# EAGLE design MAINBOARD (EAGLE 7.6.0)
AUTHOR: F. Burian / T. Divacky; PROJECT_DESC: Main driver board; PROJECT_NAME: KAMbot; REVISION: A
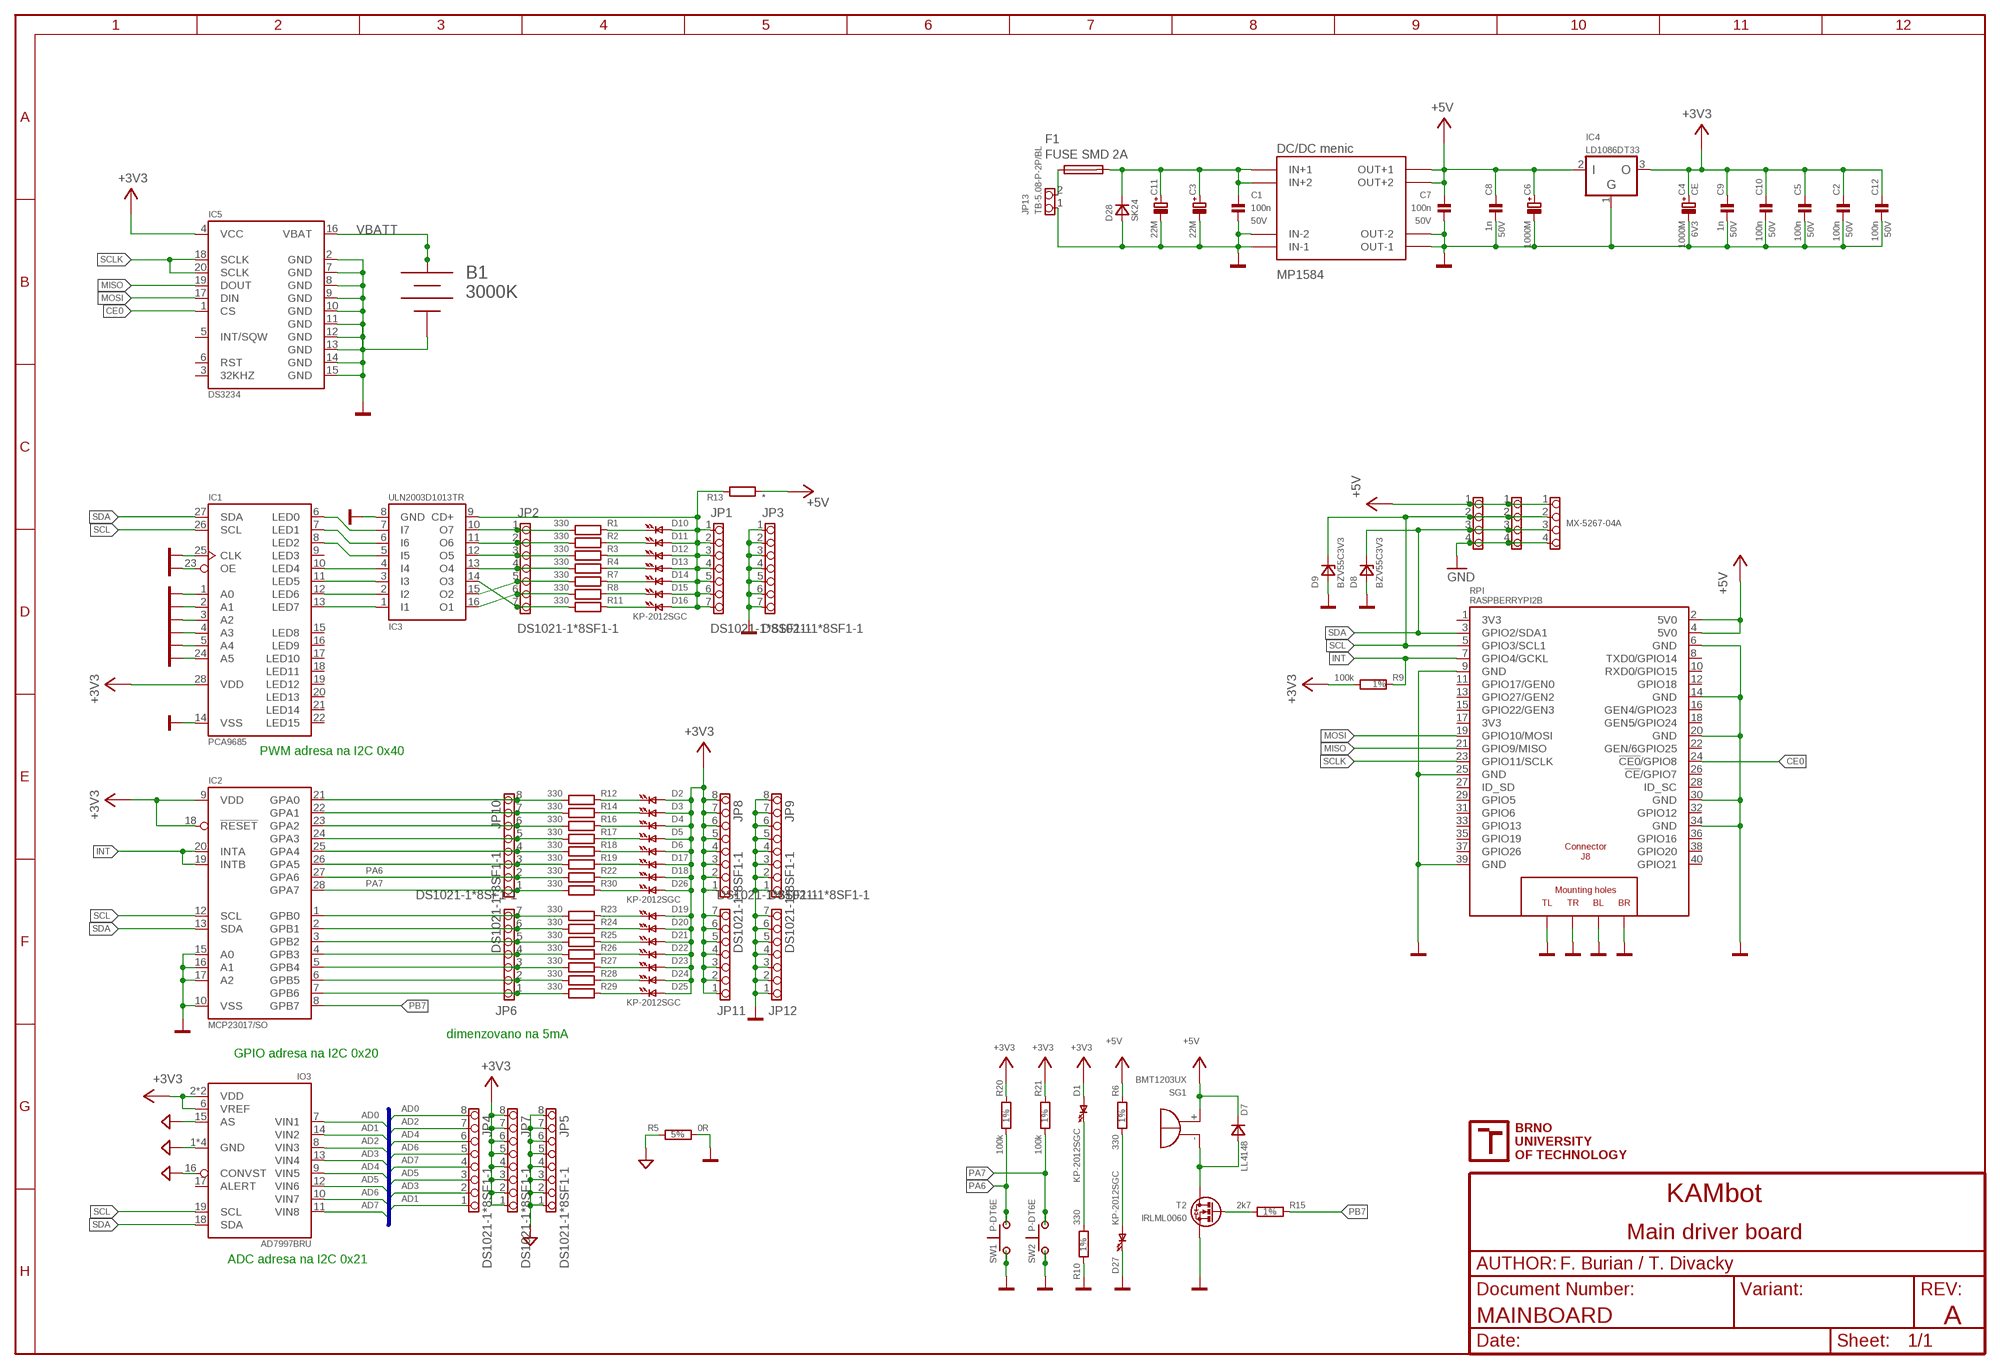
[diagram p0: schematic, sheet 1]

## Parts
B1  3000K  [3000K]
C1  100n  C0805  [0805]
C2  100n  C0805  [0805]
C3  22M  CECT7343  [CT7343D]
C4  1000M  CE_D10L13_L  [CE_D10L13_L]
C5  100n  C0805  [0805]
C6  1000M  CE_D10L13_R  [CE_D10L13_R]
C7  100n  C0805  [0805]
C8  1n  C0805  [0805]
C9  1n  C0805  [0805]
C10  100n  C0805  [0805]
C11  22M  CECT7343  [CT7343D]
C12  100n  C0805  [0805]
D1  KP-2012SGC  LED0805  [LED_0805]
D2  KP-2012SGC  LED0805  [LED_0805]
D3  KP-2012SGC  LED0805  [LED_0805]
D4  KP-2012SGC  LED0805  [LED_0805]
D5  KP-2012SGC  LED0805  [LED_0805]
D6  KP-2012SGC  LED0805  [LED_0805]
D7  LL4148  D_SOD80  [D_SOD80]
D8  BZV55C3V3  D_ZENER_SOD80  [D_SOD80]
D9  BZV55C3V3  D_ZENER_SOD80  [D_SOD80]
D10  KP-2012SGC  LED0805  [LED_0805]
D11  KP-2012SGC  LED0805  [LED_0805]
D12  KP-2012SGC  LED0805  [LED_0805]
D13  KP-2012SGC  LED0805  [LED_0805]
D14  KP-2012SGC  LED0805  [LED_0805]
D15  KP-2012SGC  LED0805  [LED_0805]
D16  KP-2012SGC  LED0805  [LED_0805]
D17  KP-2012SGC  LED0805  [LED_0805]
D18  KP-2012SGC  LED0805  [LED_0805]
D19  KP-2012SGC  LED0805  [LED_0805]
D20  KP-2012SGC  LED0805  [LED_0805]
D21  KP-2012SGC  LED0805  [LED_0805]
D22  KP-2012SGC  LED0805  [LED_0805]
D23  KP-2012SGC  LED0805  [LED_0805]
D24  KP-2012SGC  LED0805  [LED_0805]
D25  KP-2012SGC  LED0805  [LED_0805]
D26  KP-2012SGC  LED0805  [LED_0805]
D27  KP-2012SGC  LED0805  [LED_0805]
D28  SK24  D_SMB  [D_SMB]
DC1  MP1584  DC-DC-STEPDOWN-MALEJ  [DC-DC-STEP-DOWN-MALEJ]
F1  FUSE SMD 2A  FUSE_SMD_OMNI-BLOK  [FUSE_SMD]
IC1  PCA9685  [TSSOP28]
IC2  MCP23017/SO  [SO28W]
IC3  ULN2003D1013TR  ULN200X_SO  [SO16]
IC4  LD1086DT33  LD1086  [TO252]
IC5  DS3234  [SO20W]
IO3  AD7997BRU  [TSSOP20]
JP1  DS1021-1*8SF1-1  PINHD-1X7  [1X07_254_M]
JP2  DS1021-1*8SF1-1  PINHD-1X7  [1X07_254_M]
JP3  DS1021-1*8SF1-1  PINHD-1X7  [1X07_254_M]
JP4  DS1021-1*8SF1-1  PINHD-1X8  [1X08_254_M]
JP5  DS1021-1*8SF1-1  PINHD-1X8  [1X08_254_M]
JP6  DS1021-1*8SF1-1  PINHD-1X7  [1X07_254_M]
JP7  DS1021-1*8SF1-1  PINHD-1X8  [1X08_254_M]
JP8  DS1021-1*8SF1-1  PINHD-1X8  [1X08_254_M]
JP9  DS1021-1*8SF1-1  PINHD-1X8  [1X08_254_M]
JP10  DS1021-1*8SF1-1  PINHD-1X8  [1X08_254_M]
JP11  DS1021-1*8SF1-1  PINHD-1X7  [1X07_254_M]
JP12  DS1021-1*8SF1-1  PINHD-1X7  [1X07_254_M]
JP13  TB-5.08-P-2P/BL  PINHD-1X2_508_SROUB  [1X02_508_SROUB]
JP19  MX-5267-04A  PINHD-1X4_250_MX5267  [1X04_250_MX5267]
JP25  MX-5267-04A  PINHD-1X4_250_MX5267  [1X04_250_MX5267]
JP26  MX-5267-04A  PINHD-1X4_250_MX5267  [1X04_250_MX5267]
R1  330  R_R0805  [0805]
R2  330  R_R0805  [0805]
R3  330  R_R0805  [0805]
R4  330  R_R0805  [0805]
R5  0R  R_R1206  [1206]
R6  330  R_R0805  [0805]
R7  330  R_R0805  [0805]
R8  330  R_R0805  [0805]
R9  100k  R_R0805  [0805]
R10  330  R_R0805  [0805]
R11  330  R_R0805  [0805]
R12  330  R_R0805  [0805]
R13  *  R_R0805  [0805]
R14  330  R_R0805  [0805]
R15  2k7  R_R0805  [0805]
R16  330  R_R0805  [0805]
R17  330  R_R0805  [0805]
R18  330  R_R0805  [0805]
R19  330  R_R0805  [0805]
R20  100k  R_R0805  [0805]
R21  100k  R_R0805  [0805]
R22  330  R_R0805  [0805]
R23  330  R_R0805  [0805]
R24  330  R_R0805  [0805]
R25  330  R_R0805  [0805]
R26  330  R_R0805  [0805]
R27  330  R_R0805  [0805]
R28  330  R_R0805  [0805]
R29  330  R_R0805  [0805]
R30  330  R_R0805  [0805]
RPI  RASPBERRYPI2B  [RASPBERRYPI2]
SG1  BMT1203UX  BMT1205XH7.5  [BMT1205XH7.5]
SW1  P-DT6E  [P-DTE6]
SW2  P-DT6E  [P-DTE6]
T2  IRLML0060  _EMOS_N_SOT23_GDS  [SOT23]

## Nets
+3V3: C2.1 C4.P(+) C5.1 C9.2 C10.2 C12.1 D1.A D2.A D3.A D4.A D5.A D6.A D17.A D18.A D19.A D20.A D21.A D22.A D23.A D24.A D25.A D26.A IC1.28(VDD) IC2.9(VDD) IC2.18(!RESET) IC4.3(OUT) IC5.4(VCC) IO3.2(VDD) IO3.5(VDD) IO3.6(VREF) JP7.1 JP7.2 JP7.3 JP7.4 JP7.5 JP7.6 JP7.7 JP7.8 JP8.1 JP8.2 JP8.3 JP8.4 JP8.5 JP8.6 JP8.7 JP8.8 JP11.1 JP11.2 JP11.3 JP11.4 JP11.5 JP11.6 JP11.7 R9.1 R20.2 R21.2
+5V: C6.P(+) C7.1 C8.1 D7.C(K) DC1.OUT1+(OUT+1) DC1.OUT2+(OUT+2) IC4.2(IN) JP19.1 JP25.1 JP26.1 R6.2 R13.1 RPI.2(5V0) RPI.4(5V0) SG1.+
AD0: IO3.7(VIN1) JP4.8
AD1: IO3.14(VIN2) JP4.1
AD2: IO3.8(VIN3) JP4.7
AD3: IO3.13(VIN4) JP4.2
AD4: IO3.9(VIN5) JP4.6
AD5: IO3.12(VIN6) JP4.3
AD6: IO3.10(VIN7) JP4.5
AD7: IO3.11(VIN8) JP4.4
AGND: IO3.1(GND) IO3.3(GND) IO3.4(GND) IO3.15(AS) IO3.16(CONVST) IO3.20(GND) JP5.1 JP5.2 JP5.3 JP5.4 JP5.5 JP5.6 JP5.7 JP5.8 R5.2
B: R15.2 T2.1(G)
C: D7.A SG1.- T2.2(D)
CE0: IC5.1(CS) RPI.24(!CE0!/GPIO8)
GND: B1.- C1.2 C2.2 C3.- C4.M(-) C5.2 C6.M(-) C7.2 C8.2 C9.1 C10.1 C11.- C12.2 D8.A D9.A D27.K(C) D28.A DC1.IN1-(IN-1) DC1.IN2-(IN-2) DC1.OUT-1 DC1.OUT-2 IC1.1(A0) IC1.2(A1) IC1.3(A2) IC1.4(A3) IC1.5(A4) IC1.14(VSS) IC1.23(OE) IC1.24(A5) IC1.25(CLK) IC2.10(VSS) IC2.15(A0) IC2.16(A1) IC2.17(A2) IC3.8(GND) IC4.1(GND) IC5.2(GND) IC5.7(GND) IC5.8(GND) IC5.9(GND) IC5.10(GND) IC5.11(GND) IC5.12(GND) IC5.13(GND) IC5.14(GND) IC5.15(GND) JP3.1 JP3.2 JP3.3 JP3.4 JP3.5 JP3.6 JP3.7 JP9.1 JP9.2 JP9.3 JP9.4 JP9.5 JP9.6 JP9.7 JP9.8 JP12.1 JP12.2 JP12.3 JP12.4 JP12.5 JP12.6 JP12.7 JP13.1 JP19.4 JP25.4 JP26.4 R5.1 R10.1 RPI.6(GND) RPI.9(GND) RPI.14(GND) RPI.20(GND) RPI.25(GND) RPI.30(GND) RPI.34(GND) RPI.39(GND) RPI.PE_BL(BL) RPI.PE_BR(BR) RPI.PE_TL(TL) RPI.PE_TR(TR) SW1.1 SW1.1A SW2.1 SW2.1A T2.3(S)
INT: IC2.19(INTB) IC2.20(INTA) R9.2 RPI.7(GPIO4/GCKL)
LED0: IC1.6(LED0) IC3.7(I7)
MISO: IC5.19(DOUT) RPI.21(GPIO9/MISO)
MOSI: IC5.17(DIN) RPI.19(GPIO10/MOSI)
N$2: D26.K(C) R30.2
N$3: D2.K(C) R12.2
N$4: D18.K(C) R22.2
N$6: D17.K(C) R19.2
N$7: D6.K(C) R18.2
N$9: D27.A R6.1
N$12: C1.1 C3.+ C11.+ D28.K DC1.IN+1 DC1.IN+2 F1.2
N$16: F1.1 JP13.2
N$17: IC1.7(LED1) IC3.6(I6)
N$18: D10.A D11.A D12.A D13.A D14.A D15.A D16.A IC3.9(CD+) JP1.1 JP1.2 JP1.3 JP1.4 JP1.5 JP1.6 JP1.7 R13.2
N$19: IC1.8(LED2) IC3.5(I5)
N$20: D10.K(C) R1.2
N$21: D16.K(C) R11.2
N$22: D1.K(C) R10.2
N$24: IC1.10(LED4) IC3.4(I4)
N$25: IC1.11(LED5) IC3.3(I3)
N$26: IC1.12(LED6) IC3.2(I2)
N$27: IC1.13(LED7) IC3.1(I1)
N$28: D15.K(C) R8.2
N$29: D14.K(C) R7.2
N$30: D13.K(C) R4.2
N$31: D12.K(C) R3.2
N$32: D11.K(C) R2.2
N$33: D5.K(C) R17.2
N$34: D4.K(C) R16.2
N$35: D3.K(C) R14.2
N$37: D19.K(C) R23.2
N$38: D25.K(C) R29.2
N$39: D24.K(C) R28.2
N$40: D23.K(C) R27.2
N$41: D22.K(C) R26.2
N$42: D21.K(C) R25.2
N$43: D20.K(C) R24.2
PA0: IC2.21(GPA0) JP10.8 R12.1
PA1: IC2.22(GPA1) JP10.7 R14.1
PA2: IC2.23(GPA2) JP10.6 R16.1
PA3: IC2.24(GPA3) JP10.5 R17.1
PA4: IC2.25(GPA4) JP10.4 R18.1
PA5: IC2.26(GPA5) JP10.3 R19.1
PA6: IC2.27(GPA6) JP10.2 R20.1 R22.1 SW1.2 SW1.2A
PA7: IC2.28(GPA7) JP10.1 R21.1 R30.1 SW2.2 SW2.2A
PB0: IC2.1(GPB0) JP6.7 R23.1
PB1: IC2.2(GPB1) JP6.6 R24.1
PB2: IC2.3(GPB2) JP6.5 R25.1
PB3: IC2.4(GPB3) JP6.4 R26.1
PB4: IC2.5(GPB4) JP6.3 R27.1
PB5: IC2.6(GPB5) JP6.2 R28.1
PB6: IC2.7(GPB6) JP6.1 R29.1
PB7: IC2.8(GPB7) R15.1
PWM0: IC3.10(O7) JP2.1 R1.1
PWM1: IC3.11(O6) JP2.2 R2.1
PWM2: IC3.12(O5) JP2.3 R3.1
PWM4: IC3.13(O4) JP2.4 R4.1
PWM5: IC3.14(O3) JP2.7 R11.1
PWM6: IC3.15(O2) JP2.5 R7.1
PWM7: IC3.16(O1) JP2.6 R8.1
SCL: D9.C(K) IC1.26(SCL) IC2.12(SCL) IO3.19(SCL) JP19.2 JP25.2 JP26.2 RPI.5(GPIO3/SCL1)
SCLK: IC5.18(SCLK) IC5.20(SCLK) RPI.23(GPIO11/SCLK)
SDA: D8.C(K) IC1.27(SDA) IC2.13(SDA) IO3.18(SDA) JP19.3 JP25.3 JP26.3 RPI.3(GPIO2/SDA1)
VBATT: B1.+ B1.++ IC5.16(VBAT)
Unconnected: IC1.9(LED3) IC1.15(LED8) IC1.16(LED9) IC1.17(LED10) IC1.18(LED11) IC1.19(LED12) IC1.20(LED13) IC1.21(LED14) IC1.22(LED15) IC5.3(32KHZ) IC5.5(INT/SQW) IC5.6(RST) IO3.17(ALERT) RPI.1(3V3) RPI.8(TXD0/GPIO14) RPI.10(RXD0/GPIO15) RPI.11(GPIO17/GEN0) RPI.12(GPIO18) RPI.13(GPIO27/GEN2) RPI.15(GPIO22/GEN3) RPI.16(GEN4/GPIO23) RPI.17(3V3) RPI.18(GEN5/GPIO24) RPI.22(GEN/6GPIO25) RPI.26(!CE!/GPIO7) RPI.27(ID_SD) RPI.28(ID_SC) RPI.29(GPIO5) RPI.31(GPIO6) RPI.32(GPIO12) RPI.33(GPIO13) RPI.35(GPIO19) RPI.36(GPIO16) RPI.37(GPIO26) RPI.38(GPIO20) RPI.40(GPIO21)

## Buses
AD[0..7]

## Notes on the sheet
- PWM adresa na I2C 0x40
- dimenzovano na 5mA
- GPIO adresa na I2C 0x20
- ADC adresa na I2C 0x21

## Library data of the parts
B1 = #battery:3000K: SMT Battery Holder from Keystone for 12mm coin cells BR1216, CR1216, BR1220, CL1220, CR1220, BR1225; PRICE: 7.4035; URL: http://www.tme.eu/cz/details/keys3000/baterie-pouzdra-i-drzaky/keystone/3000/
C1 C2 C5 C7 C10 C12 = !discrete:C: Kondenzator; MATERIAL: X7R; PRICE: 0.16; URL: http://www.tme.eu/cz/details/cc0805krx7r9104/kondenzatory-mlcc-smd-0805/yageo/cc0805krx7r9bb104/; VOLTAGE: 50V
C3 C11 = !discrete:CE: Kondenzator Elektrolyt; MATERIAL: CT; PRICE: 7.60; URL: http://www.tme.eu/cz/details/293d226x9025d2te3/tantalove-kondenzatory-smd/vishay/; VOLTAGE: 25V
C4 C6 = !discrete:CE: Kondenzator Elektrolyt; MATERIAL: CE; PRICE: 1.80; URL: http://www.tme.eu/cz/details/pf1a102mnn1016/elektrolyticke-kondenzatory-tht-105c/elite/; VOLTAGE: 6V3
C8 C9 = !discrete:C: Kondenzator; MATERIAL: X7R; PRICE: 0.2; URL: http://www.tme.eu/cz/details/grm216r71h102ka01d/kondenzatory-mlcc-smd-0805/murata/; VOLTAGE: 50V
D1 D27 = !opto:LED: Dioda LED; PRICE: 1.00; URL: http://www.tme.eu/cz/details/kp-2012sgc/diody-led-smd-barevne/kingbright-electronic/
D2-D6 D10-D26 = !opto:LED: Dioda LED
D7 = !diody:D: Dioda; PRICE: 0.50; URL: http://www.tme.eu/cz/details/ll4148-dio/univerzalni-diody-smd/diotec-semiconductor/ll4148/
D8 D9 = !discrete:D_ZENER: Dioda Zenerova Typ Uzen Izen Pmax Pouzdro ZMMxx-SMD 2,7V...51V 5 mA 500 mW SOD80; PRICE: 0.70; URL: http://www.tme.eu/cz/details/bzv55c3v3/zenerovy-diody-smd/dc-components/
D28 = !discrete:D: Dioda; PRICE: 1.70; URL: http://www.tme.eu/cz/details/sk24-dio/diody-schottky-smd/diotec-semiconductor/sk24/
DC1 = #TD:DC-DC-STEPDOWN-MALEJ; PRICE: 13; URL: https://www.aliexpress.com/item/Free-Shipping-200PCS-MP1584-Ultra-small-size-DC-DC-step-down-power-supply-module-3A-adjustable/32660503884.html?spm=2114.01010208.3.64.EYXWIR&ws_ab_test=searchweb0_0,searchweb201602_2_10152_10065_10151_10068_10136_10137_10060_10138_10155_10062_10156_10154_10056_10055_10054_10059_10099_10103_10102_10096_10148_10147_10052_10053_10142_10107_10050_10051_10171_10084_10083_10119_10080_10082_10081_10110_10111_10112_10113_10114_10181_10078_10079_10073_10070_10123_10120_10124-10120,searchweb201603_9,afswitch_1_afChannel,ppcSwitch_7&btsid=b950b0aa-027c-4dd4-ad40-73d854bff34c&algo_expid=2c65a2a9-44e2-4a1d-9532-242fd0a7afd1-7&algo_pvid=2c65a2a9-44e2-4a1d-9532-242fd0a7afd1
F1 = #TD:FUSE_SMD_OMNI-BLOK; PRICE: 52.8862; URL: http://www.tme.eu/cz/details/0154002.drt/pojistky-smd-s-drzakem-s-opozd-reakci/littelfuse/
IC1 = !ic_nxp:PCA9685: IO - I2C PWM generátor; PRICE: 22.30; URL: https://www.aliexpress.com/item/Free-Shipping-10pcs-lot-PCA9685PW-PCA9685-TSSOP-28-new-and-original/32789324335.html?spm=2114.search0104.3.89.z2JF1U&ws_ab_test=searchweb0_0,searchweb201602_5_10152_10065_10151_10068_10171_10084_10083_10080_10304_10082_10081_10110_10137_10111_10302_10060_10112_10113_10155_10114_10154_438_10056_10055_10054_10310_10182_10059_100031_10099_10078_10079_10103_10073_10102_5360020_10052_10053_10142_10107_10050_10051,searchweb201603_16,ppcSwitch_5&btsid=9c4a8712-2313-486e-91b5-3f8d6fc67372&algo_expid=4d6a2e14-9819-4cb5-979d-3e7300dd4831-11&algo_pvid=4d6a2e14-9819-4cb5-979d-3e7300dd4831
IC2 = !ic_microchip:MCP23017: IO - I2C Expander; PRICE: 28.38; URL: http://www.tme.eu/cz/details/mcp23017-e_so/multiplexery-a-analogove-prepinace/microchip-technology/
IC3 = !uln:ULN200X: IO - Tranzistorove pole ULN2001A - 50V 500mA, GP ULN2002A - 50V 500mA 14-25V PMOS ULN2003A - 50V 500mA 5V TTL ULN2004A - 50V 500mA 6-15V CMOS; PRICE: 4.93; URL: http://www.tme.eu/cz/details/uln2003d1013tr/drivery-integrovane-obvody/st-microelectronics/
IC4 = !stab:LD1086: IO - Stabilizator 1.5A; PRICE: 18.48; URL: http://www.tme.eu/cz/details/ld1086dt33tr/stabilizatory-napeti-neregulovane-ldo/st-microelectronics/
IC5 = !ic_maxim:DS3234: DS3234 Real Time Clock; PRICE: 162.86; URL: http://www.tme.eu/cz/details/ds3234sn/pameti-sram-paralelni/maxim-dallas/ds3234sn_/
IO3 = !ic_analogdevices:AD7997: IO - A/D Konvertor; PRICE: 69.00; URL: https://www.gme.cz/ad7997bruz-0-tssop20-analog-devices
JP1-JP3 JP6 JP11 JP12 = !pinhead:PINHD-1X7: Konektor Typ Rastr Imax Umax Rmax Kontakt 2.54 mm 500 mA 125 V 50 mOhm krimp /90 2.54 mm 500 mA 125 V 50 mOhm krimp _MX5267 2.50 mm 2.5 A 250 V 20 mOhm krimp _MX53048 1.25 mm 800 mA 125 V 20 mOhm krimp _PV-3.81 3.81 mm 8 A 130 V 30 mOhm ?roub; PRICE: 1.60; URL: http://www.tme.eu/cz/details/zl201-08g/konektory-hrebinky/connfly/ds1021-1_8sf1-1/
JP4 JP5 JP7-JP10 = !pinhead:PINHD-1X8: Konektor 8 PIN Typ Rastr Imax Umax Rmax Kontakt 2.54 mm 500 mA 125 V 50 mOhm krimp /90 2.54 mm 500 mA 125 V 50 mOhm krimp _MX5267 2.50 mm 2.5 A 250 V 20 mOhm krimp _MX53048 1.25 mm 800 mA 125 V 20 mOhm krimp _PV-3.81 3.81 mm 8 A 130 V 30 mOhm ?roub; PRICE: 1.60; URL: http://www.tme.eu/cz/details/zl201-08g/konektory-hrebinky/connfly/ds1021-1_8sf1-1/
JP13 = !pinhead:PINHD-1X2: Konektor Typ Rastr Imax Umax Rmax Kontakt 2.54 mm 500 mA 125 V 50 mOhm krimp /90 2.54 mm 500 mA 125 V 50 mOhm krimp _MX5267 2.50 mm 2.5 A 250 V 20 mOhm krimp _MX53048 1.25 mm 800 mA 125 V 20 mOhm krimp _PV-3.81 3.81 mm 8 A 130 V 30 mOhm ?roub; PRICE: 3.40; URL: http://www.tme.eu/cz/details/tb-5.08-p-2p_bl/svorkovnice-do-plosnych-spoju/ninigi/
JP19 JP25 JP26 = !pinhead:PINHD-1X4: Konektor 4 PIN Typ Rastr Imax Umax Rmax Kontakt 2.54 mm 500 mA 125 V 50 mOhm krimp /90 2.54 mm 500 mA 125 V 50 mOhm krimp _MX5267 2.50 mm 2.5 A 250 V 20 mOhm krimp _MX53048 1.25 mm 800 mA 125 V 20 mOhm krimp _PV-3.81 3.81 mm 8 A 130 V 30 mOhm ?roub; PRICE: 2.55; URL: http://www.tme.eu/cz/details/mx-5267-04a/signalove-konektory-raster-250mm/molex/022035045-22-03-5045-5267-04a/
R1-R4 R7 R8 R11 R12 R14 R16-R19 R22-R30 = !discrete:R_: Rezistor; PRICE: 0.15; URL: http://www.tme.eu/cz/details/smd0805-330r/rezistory-smd-0805/royal-ohm/0805s8j0331t5e/
R5 = !discrete:R_: Rezistor; PRICE: 0.2; TOLERANCE: 5%; URL: http://www.tme.eu/cz/details/crcw12060000z0tabc/rezistory-smd-1206/vishay/
R6 R10 = !discrete:R_: Rezistor; PRICE: 0.22; TOLERANCE: 1%; URL: http://www.tme.eu/cz/details/smd0805-330r-1%25/rezistory-smd-0805/royal-ohm/0805s8f3300t5e/
R9 R20 R21 = !discrete:R_: Rezistor; PRICE: 0.22; TOLERANCE: 1%; URL: http://www.tme.eu/cz/details/smd0805-100k-1%25/rezistory-smd-0805/royal-ohm/0805s8f1003t5e/
R13 = !discrete:R_: Rezistor
R15 = !discrete:R_: Rezistor; PRICE: 0.22; TOLERANCE: 1%; URL: http://www.tme.eu/cz/details/rc0805fr-072k7/rezistory-smd-0805/yageo/rc0805fr-072k7l/
RPI = #TD:RASPBERRYPI2B: Raspberry Pi B+ Based on issue: Thursday, July 10, 2014 - Rev 1.2 LBR by Tim R. 07-2014; PRICE: 1029; URL: http://rpishop.cz/raspberry-pi-pocitace/170-raspberry-pi-2-1024-mb-ram.html
SG1 = buzzer:BMT1205XH7.5: MAGNETIC TRANSDUCER Source: Http:www.be-star.com; PRICE: 30; URL: http://www.tme.eu/cz/details/bmt-1203ux/elektromag-signalizatory-s-generatorem/bestar/bmt1203ux/
SW1 SW2 = #PaJa_prepinace:P-DT6: Tlacitkovy spinac; PRICE: 17.00; URL: http://www.tme.eu/cz/details/d6r-b/mikrospinace-tact-pcb/ck/d6r-90-f1-lfs/
T2 = !transistor:_EMOS_N_: Tranzistor MOSFET - ENHANCED s N kanalem Typ UgsT Uds Id0 Pt rdson Pouzdro BS170 3V 60 V 500 mA 350 mW 1,8 - 5,0 Ohm TO92_SGD IRFZ44N 4V 55 V 49 A 110 W 22 mOhm TO220_GDS IRLR110 2V 100 V 4,3 A 25 W(2.5W) 540 mOhm TO252_GDS IRFP260N 4V 200 V 50 A 300 W 40 mOhm TO247AC_GDS BSS138 1.5V 50 V 220 mA 360 mW 5.8 Ohm SOT23_GDS BSS123 2V 50 V 170 mA 360 mW 10 Ohm SOT23_GDS BSS123L 2V 100 V 170 mA 360 mW 10 Ohm SOT23_GDS IRLML6246 [kompl. 2246] 1.1V 30 V 5 A 360 mW 30 mOhm SOT23_GDS IRFL210 2 - 4V 200 V 0.9 A 3.1 W 1.5 Ohm SOT223_GDS; PRICE: 3.00; URL: http://www.tme.eu/cz/details/irlml0060trpbf/tranzistory-s-kanalem-n-smd/infineon-irf/

## Board
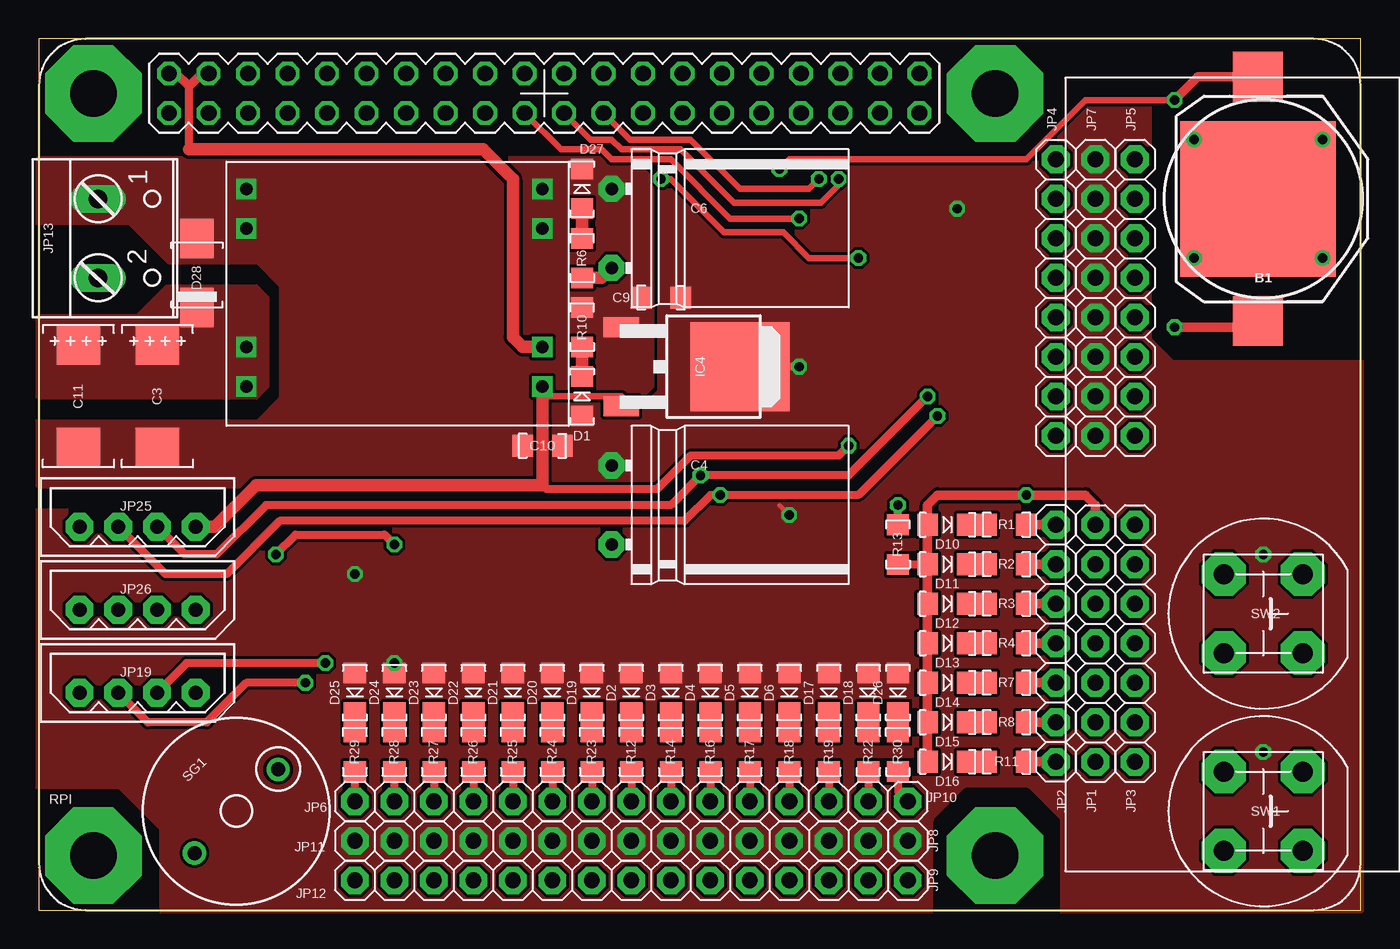
[diagram p1: board, top side]
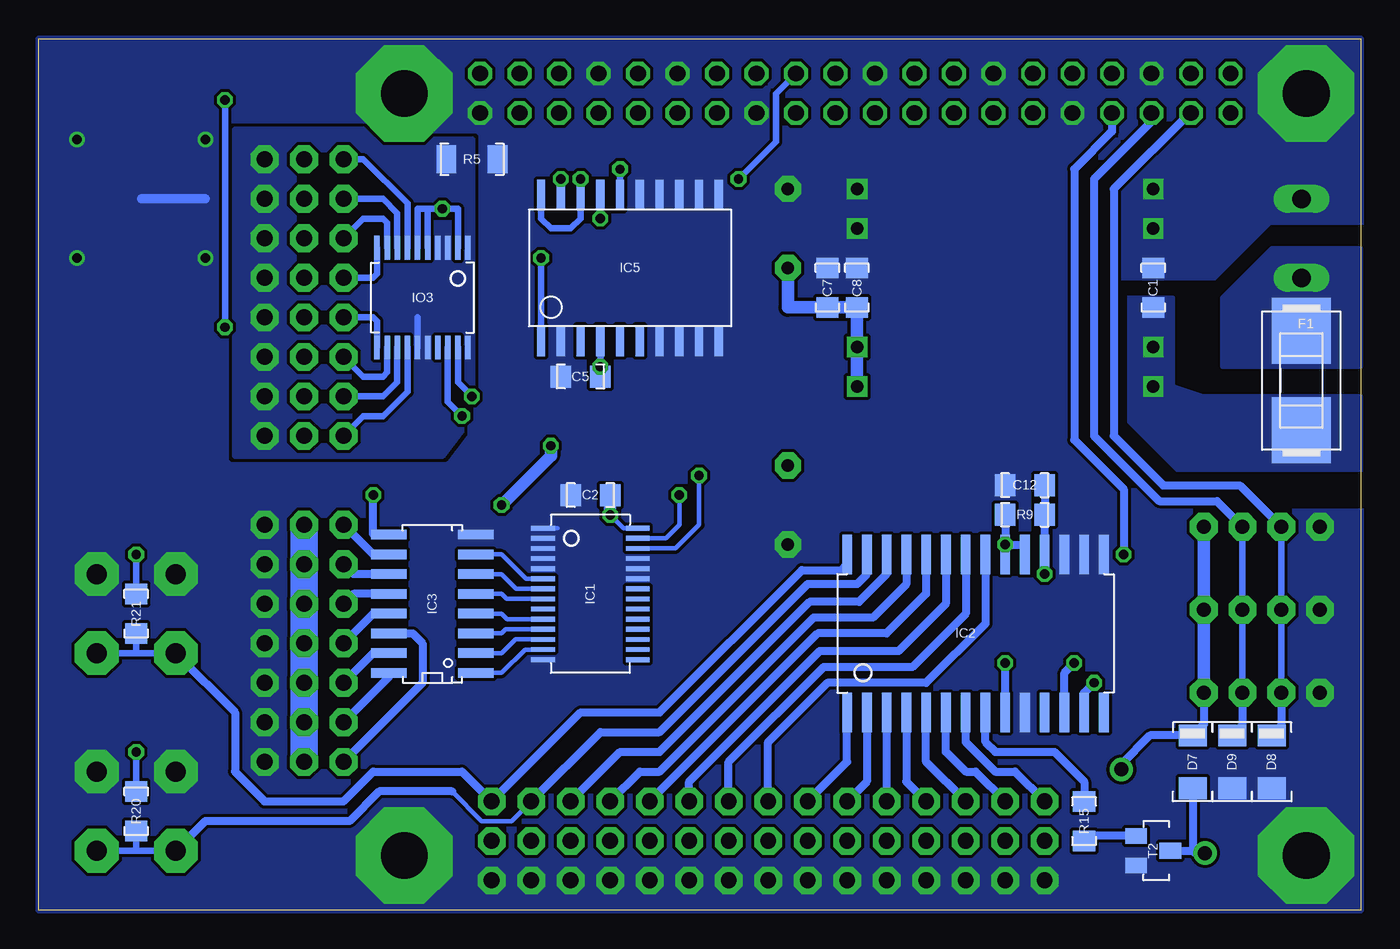
[diagram p2: board, bottom side, seen from below]

Size 85 x 56 mm. Coordinates in mm from the lower left corner, seen from the top.
Outline: 0,0 85,0 85,56 0,56 0,0
Copper layers (1*16): Top 0.035mm / dielectric 1.5mm / Bottom 0.035mm
Design rules "burianDRU *": minimum track width 10mil, minimum drill 0.6mm, track to track 8mil, track to pad 8mil, pad to pad 8mil, via to via 8mil, smd to smd 0mil, copper to edge 0mil, drill to drill 8mil, minimum pad ring 10mil, minimum via ring 8mil, stop-mask expansion 4mil, vias tented up to drill 0.6mm, thermal gap 10mil
tRestrict: 24 lines
bRestrict: 7 lines

### Footprints (pad centres in the part's own frame; a part is rotated, then mirrored left to right if it is on the bottom)
3000K = smd 3.2 x 3.2: + 7.85,0.35; ++ -7.85,0.35 | smd 10 x 10: - 0,0.35
0805 = smd 1.321 x 1.422: 1 -1.27,0; 2 1.27,0
CT7343D = smd 2.54 x 2.794: + -3.302,0; - 3.302,0
CE_D10L13_L = drill 0.8 pad 1.676 octagon: M 0,2.54; P 0,-2.54
CE_D10L13_R = drill 0.8 pad 1.676 octagon: M 0,2.54; P 0,-2.54
LED_0805 = smd 1.321 x 1.422: A -1.27,0; K 1.27,0
D_SOD80 = smd 1.4 x 1.8: A 1.7,0; C -1.7,0
D_SMB = smd 2.54 x 2.159: A 2.54,0; K -1.905,0
DC-DC-STEP-DOWN-MALEJ = drill 0.8 square: IN1- -8.89,5.08; IN2- -8.89,7.62; IN+1 -8.89,-2.54; IN+2 -8.89,-5.08; OUT1+ 10.16,-2.54; OUT2+ 10.16,-5.08; OUT-1 10.16,7.62; OUT-2 10.16,5.08
FUSE_SMD = smd 4.24 x 3.81: 1 -3.19,0; 2 3.19,0
TSSOP28 = smd 0.305 x 1.524: 1 -4.225,-3.048; 2 -3.575,-3.048; 3 -2.925,-3.048; 4 -2.275,-3.048; 5 -1.625,-3.048; 6 -0.975,-3.048; 7 -0.325,-3.048; 8 0.325,-3.048; 9 0.975,-3.048; 10 1.625,-3.048; 11 2.275,-3.048; 12 2.925,-3.048; 13 3.575,-3.048; 14 4.225,-3.048; 15 4.225,3.048; 16 3.575,3.048; 17 2.925,3.048; 18 2.275,3.048; 19 1.625,3.048; 20 0.975,3.048; 21 0.325,3.048; 22 -0.325,3.048; 23 -0.975,3.048; 24 -1.625,3.048; 25 -2.275,3.048; 26 -2.925,3.048; 27 -3.575,3.048; 28 -4.225,3.048
SO28W = smd 0.635 x 2.54: 1 -7.62,-5.08; 2 -6.35,-5.08; 3 -5.08,-5.08; 4 -3.81,-5.08; 5 -2.54,-5.08; 6 -1.27,-5.08; 7 0,-5.08; 8 1.27,-5.08; 9 2.54,-5.08; 10 3.81,-5.08; 11 5.08,-5.08; 12 6.35,-5.08; 13 7.62,-5.08; 14 8.89,-5.08; 15 8.89,5.08; 16 7.62,5.08; 17 6.35,5.08; 18 5.08,5.08; 19 3.81,5.08; 20 2.54,5.08; 21 1.27,5.08; 22 0,5.08; 23 -1.27,5.08; 24 -2.54,5.08; 25 -3.81,5.08; 26 -5.08,5.08; 27 -6.35,5.08; 28 -7.62,5.08
SO16 = smd 0.61 x 2.286: 1 -4.445,-2.794; 2 -3.175,-2.794; 3 -1.905,-2.794; 4 -0.635,-2.794; 5 0.635,-2.794; 6 1.905,-2.794; 7 3.175,-2.794; 8 4.445,-2.794; 9 4.445,2.794; 10 3.175,2.794; 11 1.905,2.794; 12 0.635,2.794; 13 -0.635,2.794; 14 -1.905,2.794; 15 -3.175,2.794; 16 -4.445,2.794
TO252 = smd 1.27 x 2.286: 1 -2.54,-5.08; 2 2.54,-5.08 | smd 5.715 x 6.35: 3 0,2.54
SO20W = smd 0.53 x 1.98: 1 -5.715,-4.685; 2 -4.445,-4.685; 3 -3.175,-4.685; 4 -1.905,-4.685; 5 -0.635,-4.685; 6 0.635,-4.685; 7 1.905,-4.685; 8 3.175,-4.685; 9 4.445,-4.685; 10 5.715,-4.685; 11 5.715,4.685; 12 4.445,4.685; 13 3.175,4.685; 14 1.905,4.685; 15 0.635,4.685; 16 -0.635,4.685; 17 -1.905,4.685; 18 -3.175,4.685; 19 -4.445,4.685; 20 -5.715,4.685
TSSOP20 = smd 0.356 x 1.524: 1 -2.925,-3.2; 2 -2.275,-3.2; 3 -1.625,-3.2; 4 -0.975,-3.2; 5 -0.325,-3.2; 6 0.325,-3.2; 7 0.975,-3.2; 8 1.625,-3.2; 9 2.275,-3.2; 10 2.925,-3.2; 11 2.925,3.2; 12 2.275,3.2; 13 1.625,3.2; 14 0.975,3.2; 15 0.325,3.2; 16 -0.325,3.2; 17 -0.975,3.2; 18 -1.625,3.2; 19 -2.275,3.2; 20 -2.925,3.2
1X07_254_M = drill 1.016 pad 1.778 octagon: 1 -7.62,0; 2 -5.08,0; 3 -2.54,0; 4 0,0; 5 2.54,0; 6 5.08,0; 7 7.62,0
1X08_254_M = drill 1.016 pad 1.778 octagon: 1 -8.89,0; 2 -6.35,0; 3 -3.81,0; 4 -1.27,0; 5 1.27,0; 6 3.81,0; 7 6.35,0; 8 8.89,0
1X02_508_SROUB = drill 1.194 long: 1 -2.54,-0.635; 2 2.54,-0.635
1X04_250_MX5267 = drill 0.9 pad 1.778 octagon: 1 -3.734,0; 2 -1.245,0; 3 1.245,0; 4 3.734,0
1206 = smd 1.27 x 1.778: 1 -1.651,0; 2 1.651,0
RASPBERRYPI2 = drill 1.016 octagon: 1 8.37,51.23; 2 8.37,53.77; 3 10.91,51.23; 4 10.91,53.77; 5 13.45,51.23; 6 13.45,53.77; 7 15.99,51.23; 8 15.99,53.77; 9 18.53,51.23; 10 18.53,53.77; 11 21.07,51.23; 12 21.07,53.77; 13 23.61,51.23; 14 23.61,53.77; 15 26.15,51.23; 16 26.15,53.77; 17 28.69,51.23; 18 28.69,53.77; 19 31.23,51.23; 20 31.23,53.77; 21 33.77,51.23; 22 33.77,53.77; 23 36.31,51.23; 24 36.31,53.77; 25 38.85,51.23; 26 38.85,53.77; 27 41.39,51.23; 28 41.39,53.77; 29 43.93,51.23; 30 43.93,53.77; 31 46.47,51.23; 32 46.47,53.77; 33 49.01,51.23; 34 49.01,53.77; 35 51.55,51.23; 36 51.55,53.77; 37 54.09,51.23; 38 54.09,53.77; 39 56.63,51.23; 40 56.63,53.77 | drill 3 pad 6.2 octagon: PE_BL 3.5,3.5; PE_BR 61.5,3.5; PE_TL 3.5,52.5; PE_TR 61.5,52.5
BMT1205XH7.5 = drill 0.9 pad 1.5: + 3.8,0; - -3.8,0
P-DTE6 = drill 1.27 pad 2.8 octagon: 1 -2.54,-2.54; 1A -2.54,2.54; 2 2.54,-2.54; 2A 2.54,2.54
SOT23 = smd 1 x 1.4: 1 -0.95,-1.1; 2 0,1.1; 3 0.95,-1.1

### Placement (x,y rotation side)
B1  78.74,45.72 90 top
C1  13.34,40.01 90 bottom
C2  49.53,26.67 180 bottom
C3  7.62,33.02 270 top
C4  36.83,26.04 180 top
C5  50.16,34.29 180 bottom
C6  36.83,43.81 0 top
C7  34.29,40.01 90 bottom
C8  32.38,40.01 90 bottom
C9  40.01,39.37 0 top
C10  32.38,29.84 0 top
C11  2.54,33.02 270 top
C12  21.59,27.3 180 bottom
D1  34.92,33.02 90 top
D2  38.1,13.97 270 top
D3  40.64,13.97 270 top
D4  43.18,13.97 270 top
D5  45.72,13.97 270 top
D6  48.26,13.97 270 top
D7  10.79,9.53 270 bottom
D8  5.71,9.53 270 bottom
D9  8.26,9.53 270 bottom
D10  58.42,24.77 0 top
D11  58.42,22.23 0 top
D12  58.42,19.68 0 top
D13  58.42,17.14 0 top
D14  58.42,14.61 0 top
D15  58.42,12.06 0 top
D16  58.42,9.53 0 top
D17  50.8,13.97 270 top
D18  53.34,13.97 270 top
D19  35.56,13.97 270 top
D20  33.02,13.97 270 top
D21  30.48,13.97 270 top
D22  27.94,13.97 270 top
D23  25.4,13.97 270 top
D24  22.86,13.97 270 top
D25  20.32,13.97 270 top
D26  55.24,13.97 270 top
D27  34.92,46.35 90 top
D28  10.16,40.64 90 top
DC1  22.23,38.73 0 top
F1  3.81,34.04 270 bottom
IC1  49.53,20.32 270 bottom
IC2  25.4,17.78 0 bottom
IC3  59.69,19.68 90 bottom
IC4  42.55,34.92 270 top
IC5  46.99,41.27 0 bottom
IO3  60.33,39.37 180 bottom
JP1  67.94,17.14 90 top
JP2  65.41,17.14 270 top
JP3  70.48,17.14 90 top
JP4  65.41,39.37 90 top
JP5  70.48,39.37 90 top
JP6  27.94,6.99 0 top
JP7  67.94,39.37 90 top
JP8  46.99,4.45 0 top
JP9  46.99,1.91 0 top
JP10  46.99,6.99 180 top
JP11  27.94,4.45 0 top
JP12  27.94,1.91 0 top
JP13  4.45,43.18 270 top
JP19  6.35,13.97 180 top
JP25  6.35,24.64 180 top
JP26  6.35,19.3 180 top
R1  62.23,24.77 180 top
R2  62.23,22.23 180 top
R3  62.23,19.68 180 top
R4  62.23,17.14 180 top
R5  57.15,48.26 180 bottom
R6  34.92,41.91 270 top
R7  62.23,14.61 180 top
R8  62.23,12.06 180 top
R9  21.59,25.4 180 bottom
R10  34.92,37.47 270 top
R11  62.23,9.53 180 top
R12  38.1,10.16 90 top
R13  55.24,23.5 270 top
R14  40.64,10.16 90 top
R15  17.78,5.71 270 bottom
R16  43.18,10.16 90 top
R17  45.72,10.16 90 top
R18  48.26,10.16 90 top
R19  50.8,10.16 90 top
R20  78.74,6.35 90 bottom
R21  78.74,19.05 90 bottom
R22  53.34,10.16 90 top
R23  35.56,10.16 90 top
R24  33.02,10.16 90 top
R25  30.48,10.16 90 top
R26  27.94,10.16 90 top
R27  25.4,10.16 90 top
R28  22.86,10.16 90 top
R29  20.32,10.16 90 top
R30  55.24,10.16 90 top
RPI  0,0 0 top
SG1  12.7,6.35 45 top
SW1  78.74,6.35 270 top
SW2  78.74,19.05 270 top
T2  13.34,3.81 270 bottom
U$2  [DIN_A4_1:2]  127,-29.21 90 top  (outside the outline)
U$3  [RAZITKO_1:2]  76.2,-29.21 0 top  (outside the outline)
U$4  [VUT_LOGO]  46.35,-26.67 0 top  (outside the outline)

### Tracks (layer width: path | path; a pad name or v marks a point on that pad's centre or on a via)
+3V3  (via drill 0.6)
  Top 0.305: v48.26,25.4 47.62,26.04
  Top 0.508: v48.9,34.92 47.62,34.92
  Bottom 0.305: IC1.28 47.41,24.55 v48.26,25.4
  Bottom 0.406: IO3.6 60.65,45.09 60,45.09 | 60,45.09 v59.05,45.09 58.05,45.09 IO3.2 | IO3.5 60,45.09 | R20.2 v78.74,10.16 | R21.2 v78.74,22.86 | IC5.4 v48.9,34.92
  Bottom 0.508: C5.1 v48.9,34.92 | C12.1 R9.1 IC2.18 v20.32,21.59 | IC2.9 v22.86,15.88
  Bottom 0.813: C2.1 v48.26,25.4
  pour Top (rank 6, no thermals): 0,56 85,56 85,0 0,0
+5V  (via drill 0.6)
  Top 0.406: 32.38,33.02 37.47,33.02 IC4.2
  Top 0.508: 9.65,48.9 9.65,52.96 | R13.1 v55.24,26.04 | v52.07,29.84 51.44,29.21 41.91,29.21 39.75,27.05 32.64,27.05 32.38,27.3
  Top 0.61: RPI.2 8.84,53.77 9.65,52.96 10.46,53.77 RPI.4
  Top 0.813: 9.65,48.9 28.57,48.9 30.48,46.99 30.48,36.83 31.11,36.2 DC1.OUT1+ | JP25.1 11.3,24.64 13.97,27.3 32.38,27.3 32.38,33.02 DC1.OUT2+ | R6.2 36.2,40.64 C6.P
  Bottom 0.508: JP19.1 10.08,11.94 D7.C 13.54,11.22 15.39,9.38 SG1.+
  Bottom 0.813: DC1.OUT2+ DC1.OUT1+ C8.1 C7.1 36.83,38.73 C6.P | JP19.1 JP26.1 JP25.1 | v55.24,26.04 52.07,29.21 v52.07,29.84
AD0
  Bottom 0.406: IO3.7 61.3,45.42 64.14,48.26 JP4.8
AD1
  Bottom 0.406: IO3.14 61.3,33.31 62.87,31.75 64.14,31.75 JP4.1
AD2
  Bottom 0.406: IO3.8 61.95,44.8 62.87,45.72 JP4.7
AD3
  Bottom 0.406: IO3.13 61.95,33.94 62.87,33.02 JP4.2
AD4
  Bottom 0.406: IO3.9 62.6,44.19 62.87,44.45 64.14,44.45 JP4.6
AD5
  Bottom 0.406: IO3.12 62.6,34.55 62.87,34.29 64.14,34.29 JP4.3
AD6
  Bottom 0.406: IO3.10 63.25,40.89 63.5,40.64 JP4.5
AD7
  Bottom 0.406: IO3.11 63.25,37.85 63.5,38.1 JP4.4
AGND
  Bottom 0.406: IO3.15 60.65,38.1
  pour Bottom (no thermals): 57.15,49.53 63.5,49.53 64.14,50.16 72.39,50.16 72.39,29.21 59.05,29.21 57.15,31.75
B
  Bottom 0.508: T2.1 17.46,4.76 R15.2
C
  Bottom 0.508: D7.A 10.79,3.81 | T2.2 10.79,3.81 | SG1.- 10.65,3.66 10.79,3.81
CE0  (via drill 0.6)
  Top 0.406: v40.01,46.99 40.64,46.99 44.07,43.56 47.88,43.56 49.53,41.91 v52.7,41.91
  Bottom 0.406: RPI.24 37.59,52.49 37.59,49.4 v40.01,46.99 | IC5.1 v52.7,41.91
GND  (via drill 0.6)
  Top 0.61: B1.- 74.58,41.91 v74.3,41.91 78.11,45.72 B1.-
  Bottom 0.305: IC1.1 51.66,24.55
  Bottom 0.61: 74.3,45.72 B1.-
  other vias: 74.3,49.53 82.55,49.53 82.55,41.91
  pour Bottom (rank 2, no thermals): 0,56 85,56 85,0 0,0
  pour Top (rank 2, no thermals): 0,48.26 38.1,48.26 39.37,46.99 39.37,33.66 38.1,32.38 33.02,32.38 32.38,31.75 32.38,27.3 0,27.3
INT  (via drill 0.6)
  Top 0.508: v15.24,22.86 16.51,24.13 22.23,24.13 v22.86,23.5
  Bottom 0.508: RPI.7 15.99,50.05 18.41,47.62 18.41,30.23 15.24,27.05 v15.24,22.86 | v22.86,23.5 21.59,23.5 IC2.19 | R9.2 v22.86,23.5 | IC2.20 v22.86,23.5
LED0
  Bottom 0.305: IC1.6 53.68,21.3 55.24,22.86 IC3.7
MISO  (via drill 0.6)
  Top 0.406: v51.44,46.99 51.44,46.59 50.31,45.47 44.7,45.47 41.27,48.9 37.47,48.9 36.83,49.53 35.47,49.53 RPI.21
  Bottom 0.406: IC5.19 v51.44,46.99
MOSI  (via drill 0.6)
  Top 0.406: v48.9,44.45 44.45,44.45 40.64,48.26 36.83,48.26 36.2,48.9 33.56,48.9 RPI.19
  Bottom 0.406: IC5.17 v48.9,44.45
N$2
  Top 0.508: R30.2 D26.K
N$3
  Top 0.508: R12.2 D2.K
N$4
  Top 0.508: R22.2 D18.K
N$6
  Top 0.508: R19.2 D17.K
N$7
  Top 0.508: R18.2 D6.K
N$9
  Top 0.813: D27.A R6.1
N$12
  pour Bottom (no thermals): 0,33.02 10.16,33.02 12.06,33.66 12.06,39.37 15.24,39.37 15.24,31.75 11.43,27.94 0,27.94
  pour Top (no thermals): 0,38.1 6.35,38.1 8.26,40.01 13.97,40.01 14.61,39.37 14.61,33.66 13.97,33.02 0,33.02
N$16
  pour Bottom (no thermals): 0,34.92 8.89,34.92 8.89,39.37 5.71,42.55 0,42.55
N$17
  Bottom 0.305: IC1.7 54.3,20.64 55.24,21.59 IC3.6
N$18  (via drill 0.6)
  Top 0.508: R13.2 D11.A
  Top 0.61: D16.A D15.A D14.A D13.A D12.A D11.A D10.A 57.15,26.04 57.78,26.67 v63.5,26.67 67.31,26.67 67.94,26.04 JP1.7
  Bottom 0.508: IC3.9 63.5,24.13 v63.5,26.67
  Bottom 1.778: JP1.7 JP1.6 JP1.5 JP1.4 JP1.3 JP1.2 JP1.1
N$19
  Bottom 0.305: IC1.8 54.92,20 55.24,20.32 IC3.5
N$20
  Top 0.61: D10.K R1.2
N$21
  Top 0.61: D16.K R11.2
N$22
  Top 0.813: D1.K R10.2
N$24
  Bottom 0.305: IC1.10 54.89,18.7 55.24,19.05 IC3.4
N$25
  Bottom 0.305: IC1.11 54.98,18.05 55.24,17.78 IC3.3
N$26
  Bottom 0.305: IC1.12 54.36,17.39 55.24,16.51 IC3.2
N$27
  Bottom 0.305: IC1.13 53.74,16.75 55.24,15.24 IC3.1
N$28
  Top 0.61: R8.2 D15.K
N$29
  Top 0.61: D14.K R7.2
N$30
  Top 0.61: R4.2 D13.K
N$31
  Top 0.61: D12.K R3.2
N$32
  Top 0.61: R2.2 D11.K
N$33
  Top 0.508: R17.2 D5.K
N$34
  Top 0.508: R16.2 D4.K
N$35
  Top 0.508: R14.2 D3.K
N$37
  Top 0.508: R23.2 D19.K
N$38
  Top 0.508: R29.2 D25.K
N$39
  Top 0.508: R28.2 D24.K
N$40
  Top 0.508: R27.2 D23.K
N$41
  Top 0.508: R26.2 D22.K
N$42
  Top 0.508: R25.2 D21.K
N$43
  Top 0.508: R24.2 D20.K
PA0
  Top 0.508: R12.1 JP10.8
  Bottom 0.508: JP10.8 38.1,10.79 34.29,14.61 27.94,14.61 24.13,18.41 IC2.21
PA1
  Top 0.508: R14.1 JP10.7
  Bottom 0.508: JP10.7 40.64,9.53 34.54,15.62 28.83,15.62 25.4,19.05 IC2.22
PA2
  Top 0.508: R16.1 JP10.6
  Bottom 0.508: JP10.6 43.18,8.26 34.8,16.64 29.72,16.64 26.67,19.68 IC2.23
PA3
  Top 0.508: R17.1 JP10.5
  Bottom 0.508: JP10.5 34.92,17.78 30.48,17.78 27.94,20.32 IC2.24
PA4
  Top 0.508: R18.1 JP10.4
  Bottom 0.508: JP10.4 46.35,8.89 45.09,8.89 35.18,18.8 31.37,18.8 29.21,20.95 IC2.25
PA5
  Top 0.508: R19.1 JP10.3
  Bottom 0.508: JP10.3 47.62,10.16 45.09,10.16 35.43,19.81 32.26,19.81 30.48,21.59 IC2.26
PA6
  Top 0.508: R22.1 JP10.2
  Bottom 0.305: JP10.2 54.61,5.71 56.52,5.71 58.42,7.62
  Bottom 0.406: SW1.2 78.74,3.81 | 78.74,3.81 SW1.2A | R20.1 78.74,3.81
  Bottom 0.508: JP10.2 48.9,11.43 45.09,11.43 35.56,20.95 32.38,20.95 31.75,21.59 IC2.27 | 58.42,7.62 63.12,7.62 65.02,5.71 74.3,5.71 SW1.2
PA7
  Top 0.508: R30.1 55.24,7.62 JP10.1
  Bottom 0.406: SW2.2 78.74,16.51 | 78.74,16.51 SW2.2A | R21.1 78.74,16.51
  Bottom 0.508: SW2.2 72.39,12.7 72.39,8.89 70.48,6.99 65.41,6.99 63.5,8.89 57.78,8.89 JP10.1 50.16,12.7 45.09,12.7 35.94,21.84 33.4,21.84 33.02,22.23 IC2.28
PB0
  Top 0.508: R23.1 JP6.7
  Bottom 0.508: JP6.7 33.02,9.53 IC2.1
PB1
  Top 0.508: R24.1 JP6.6
  Bottom 0.508: JP6.6 31.75,8.26 IC2.2
PB2
  Top 0.508: R25.1 JP6.5
  Bottom 0.508: IC2.3 JP6.5
PB3
  Top 0.508: R26.1 JP6.4
  Bottom 0.508: JP6.4 29.21,8.26 IC2.4
PB4
  Top 0.508: R27.1 JP6.3
  Bottom 0.508: JP6.3 27.94,9.53 IC2.5
PB5
  Top 0.508: R28.1 JP6.2
  Bottom 0.508: JP6.2 24.77,8.89 25.4,8.89 26.67,10.16 IC2.6
PB6
  Top 0.508: R29.1 JP6.1
  Bottom 0.508: JP6.1 22.23,8.89 23.5,8.89 25.4,10.79 IC2.7
PB7
  Bottom 0.508: R15.1 17.78,8.26 19.68,10.16 23.5,10.16 24.13,10.79 IC2.8
PWM0
  Top 0.61: R1.1 JP2.1
  Bottom 0.508: IC3.10 63.5,22.86 JP2.1
PWM1
  Top 0.61: R2.1 JP2.2
  Bottom 0.508: IC3.11 64.77,21.59 JP2.2
PWM2
  Top 0.61: R3.1 JP2.3
  Bottom 0.508: IC3.12 64.77,20.32 JP2.3
PWM4
  Top 0.61: R4.1 JP2.4
  Bottom 0.508: IC3.13 63.5,19.05 JP2.4
PWM5
  Top 0.61: R11.1 JP2.7
  Bottom 0.508: IC3.14 60.96,17.78 60.33,17.14 60.33,14.61 JP2.7
PWM6
  Top 0.61: R7.1 JP2.5
  Bottom 0.508: IC3.15 63.5,16.51 JP2.5
PWM7
  Top 0.61: R8.1 JP2.6
  Bottom 0.508: IC3.16 62.48,14.99 JP2.6
SCL  (via drill 0.6)
  Top 0.508: JP25.2 9.37,22.86 11.43,22.86 14.61,26.04 40.64,26.04 v42.55,27.94 52.07,27.94 v57.15,33.02 | v18.41,15.88 9.5,15.88 JP19.2
  Bottom 0.305: IC1.26 44.06,23.25 42.55,24.77 v42.55,27.94
  Bottom 0.406: IO3.19 58.05,33.92 v57.15,33.02 | JP25.2 JP26.2 JP19.2
  Bottom 0.508: RPI.5 13.45,50.69 17.14,46.99 17.14,30.48 12.95,26.29 9.25,26.29 JP25.2 | JP19.2 7.59,11.88 D9.C | v18.41,15.88 19.05,15.24 IC2.12
SCLK  (via drill 0.6)
  Top 0.406: v50.16,46.99 49.53,46.35 45.09,46.35 41.91,49.53 38.01,49.53 RPI.23
  Bottom 0.406: v50.16,46.99 IC5.18 50.16,44.45 50.8,43.81 52.07,43.81 52.7,44.45 IC5.20
SDA  (via drill 0.6)
  Top 0.508: JP25.3 8.15,21.59 12.06,21.59 15.49,25.02 41.53,25.02 43.18,26.67 v43.81,26.67 52.7,26.67 v57.78,31.75 | v17.14,14.61 13.34,14.61 10.79,12.06 7.01,12.06 JP19.3
  Bottom 0.305: IC1.27 44.69,23.89 43.81,24.77 v43.81,26.67
  Bottom 0.406: IO3.18 58.7,32.66 v57.78,31.75 | JP25.3 JP26.3 JP19.3
  Bottom 0.508: RPI.3 11,51.23 15.88,46.35 15.88,30.48 12.7,27.3 7.77,27.3 JP25.3 | JP19.3 5.11,11.84 D8.C | v17.14,14.61 17.78,13.97 IC2.13
VBATT  (via drill 0.6)
  Top 0.406: v47.62,47.62 48.26,48.26 63.5,48.26 67.31,52.07 v73.03,52.07
  Top 0.61: B1.++ 78.39,37.47 v73.03,37.47 | v73.03,52.07 74.53,53.57 B1.+
  Bottom 0.406: v73.03,37.47 v73.03,52.07 | v47.62,47.62 IC5.16

### Text on the board
tTest: B0 | B1 | B2 | B3 | B4
bTest: VUT | KamBot
tDocu: AD0 | - | AD2 | AD4 | AD6 | Brno University / of Technology | AD7 | 2017 | AD5 | + | rev A | AD3 | UAMT | FEKT | BRNO | KAMbot | AD1 | Main driver board | PWM0 | (c) Frantisek Burian | PA7 | (c) Tadeas Divacky | UAMT FEKT VUT | PB6 | PB5 | PB4 | PB3 | PB2 | PB1 | PB0 | PA0 | PA1 | PA2 | PA3 | PA4 | PA5 | PA6 | PA7 | PA6 | PB7 | GND | SDA | SCL | +5V | PWM1 | PWM2 | PWM4 | PWM6 | PWM7 | PWM5